# EAGLE design Speaker Amplifier (EAGLE 7.2.0)
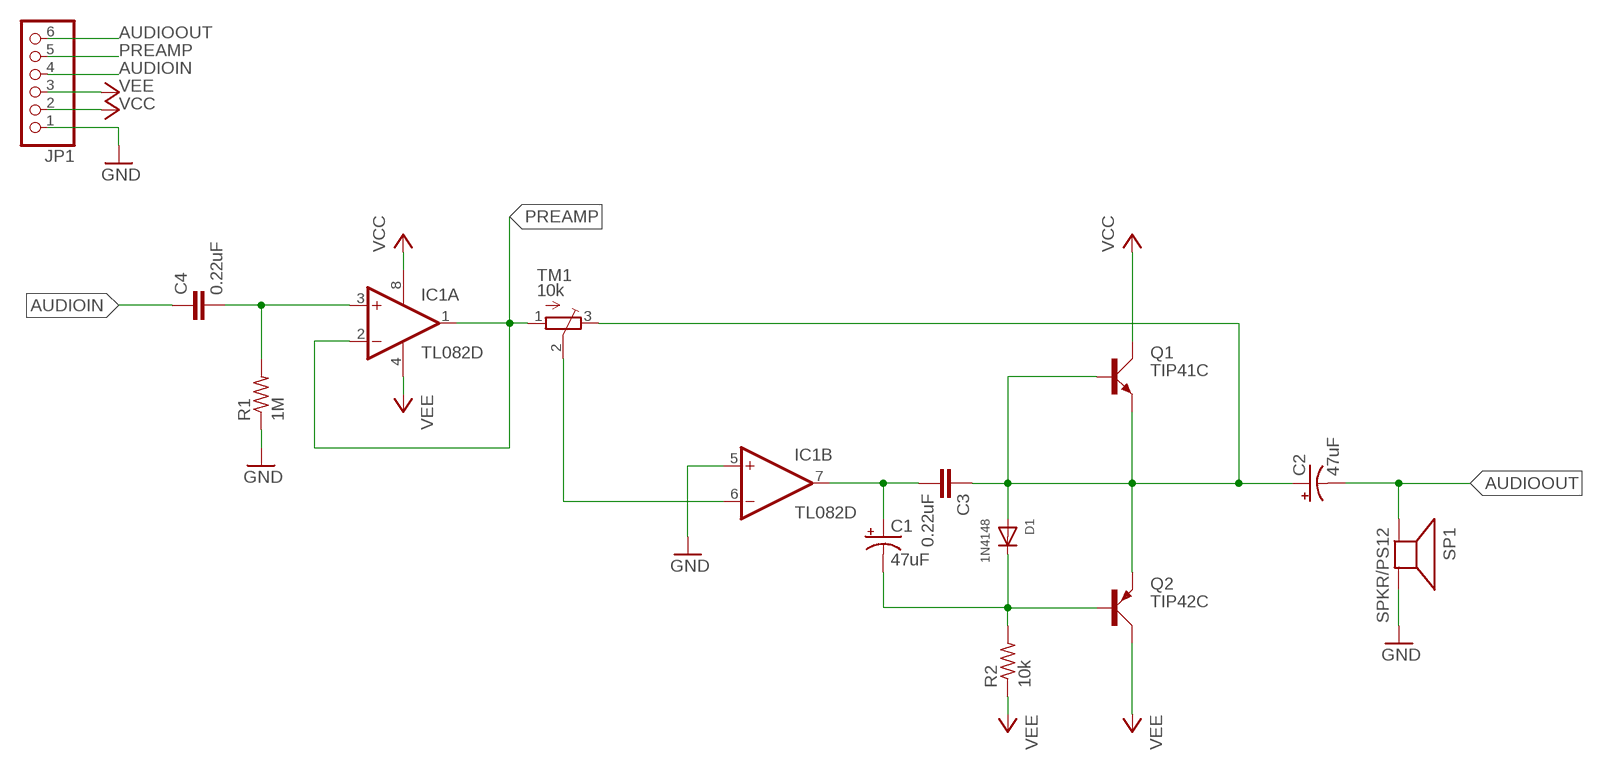
[diagram p0: schematic, sheet 1]

## Parts
C1  47uF  CPOL-US153CLV-0810  [153CLV-0810]
C2  47uF  CPOL-US153CLV-0810  [153CLV-0810]
C3  0.22uF  C-EUC0805  [C0805]
C4  0.22uF  C-EUC0805  [C0805]
D1  1N4148  DIODESOD-323F  [SOD-323F]
IC1  TL082D  [SO08]
JP1  PINHD-1X6-3.5MM  [1X06-3.5MM]
Q1  TIP41C  [TO220AV]
Q2  TIP42C  [TO220AV]
R1  1M  R-US_R0805  [R0805]
R2  10k  R-US_R0805  [R0805]
SP1  SPKR/PS12  SPEAKER/PS12  [PS12]
TM1  10k  TRIMPOTTC33X  [TC33X]

## Nets
AUDIOIN: C4.1 JP1.4
AUDIOOUT: C2.- JP1.6 SP1.P$1(+)
GND: IC1.5(B:+IN) JP1.1 R1.1 SP1.P$2(-)
N$1: C4.2 IC1.3(A:+IN) R1.2
N$3: C1.- D1.C Q2.B R2.2
N$4: C1.+ C3.2 IC1.7(B:OUT)
N$5: C2.+ C3.1 D1.A Q1.B Q1.E Q2.E TM1.3(E)
N$8: IC1.6(B:-IN) TM1.2(S)
PREAMP: IC1.1(A:OUT) IC1.2(A:-IN) JP1.5 TM1.1(A)
VCC: IC1.4(P:V-) IC1.8(P:V+) JP1.2 JP1.3 Q1.C Q2.C R2.1 ; supply symbol labelled VEE

## Library data of the parts
C1 C2 = resistor:CPOL-US: POLARIZED CAPACITOR, American symbol
C3 C4 = resistor:C-EU: CAPACITOR, European symbol
D1 = adafruit:DIODE: Diode SMADIODE - SMA Surface Mount Package 20V 1A Schottky Diode Digikey: 641-1014-6-ND DO-1N4148 - Through Hole Small Current Diode SOD-123 20V 1 A (.5mV Vf) Schottky Diode - Digikey: MBRX120TPMSCT-ND SOD-323 10V 570mA (.38mV Vf, 3ns) Schottky Diode - Digikey: ZLLS410CT-ND SOD-523 30V 30mA Schottky Diode (RB751S-40TE61) - Digikey: RB751S-40TE61CT-ND SOT23-R/W - SOT23 Package (R = Solder Paste/Reflow Ovens, W = Hand-Soldering) BAT54Film 40V 300mA - Digikey: 497-7162-1-ND
IC1 = linear:TL082: OP AMP Data sheet <http://www.ti.com/lit/ds/symlink/tl084a . pdf>; DATA_SHEET: <a href="http://www.ti.com/lit/ds/symlink/tl084a.pdf"> Data sheet </a>
JP1 = adafruit:PINHD-1X6: PIN HEADER
Q1 = transistor-power:TIP41C: NPN TRANSISTOR
Q2 = transistor-power:TIP42C: PNP TRANSISTOR
R1 R2 = resistor:R-US_: RESISTOR, American symbol
SP1 = adafruit:SPEAKER: SPEAKER Source: Buerklin Added PS12 (for part # PS1240 piezo) http://www.ladyada.net/library/pcb/eaglelibrary.html
TM1 = adafruit:TRIMPOT: SMT trimmer potentiometer part number TC33X http://www.ladyada.net/library/eagle

## Board
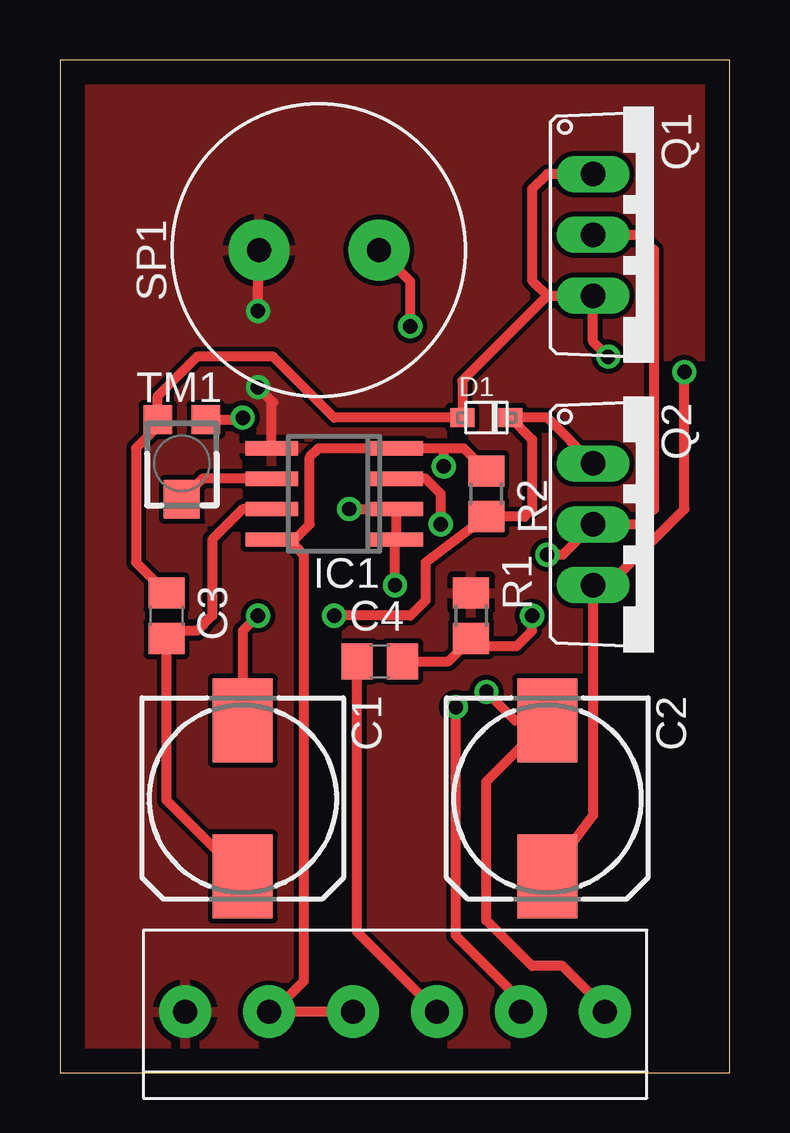
[diagram p1: board, top side]
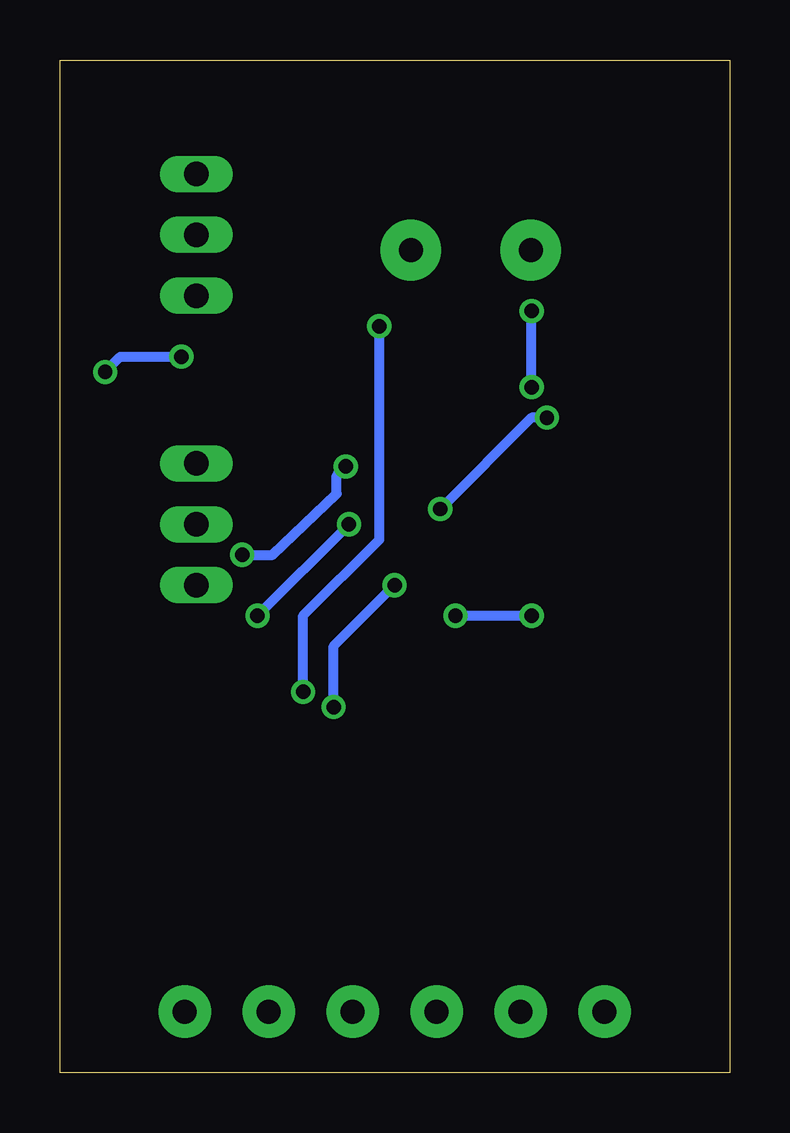
[diagram p2: board, bottom side, seen from below]

Size 27.92 x 42.22 mm. Coordinates in mm from the lower left corner, seen from the top.
Outline: 0,0 27.92,0 27.92,42.22 0,42.22 0,0
Copper layers (1*16): Top 0.035mm / dielectric 1.5mm / Bottom 0.035mm
Design rules "default": minimum track width 10mil, minimum drill 24mil, track to track 8mil, track to pad 8mil, pad to pad 8mil, via to via 8mil, smd to smd 8mil, copper to edge 40mil, drill to drill 8mil, minimum pad ring 10mil, minimum via ring 8mil, stop-mask expansion 4mil, vias tented up to drill 0mil, thermal gap 10mil

### Footprints (pad centres in the part's own frame; a part is rotated, then mirrored left to right if it is on the bottom)
153CLV-0810 = smd 3.5 x 2.5: + 3.25,0; - -3.25,0
C0805 = smd 1.3 x 1.5: 1 -0.95,0; 2 0.95,0
SOD-323F = smd 1 x 0.8: A -1,0; C 1,0
SO08 = smd 0.6 x 2.2: 1 -1.905,-2.6; 2 -0.635,-2.6; 3 0.635,-2.6; 4 1.905,-2.6; 5 1.905,2.6; 6 0.635,2.6; 7 -0.635,2.6; 8 -1.905,2.6
1X06-3.5MM = drill 1 pad 2.184: 1 -8.75,0; 2 -5.25,0; 3 -1.75,0; 4 1.75,0; 5 5.25,0; 6 8.75,0
TO220AV = drill 1.016 long: B -2.54,-2.54; C 0,-2.54; E 2.54,-2.54
R0805 = smd 1.3 x 1.5: 1 -0.95,0; 2 0.95,0
PS12 = drill 1 pad 2.54: P$1 -2.5,0; P$2 2.5,0
TC33X = smd 1.2 x 1.2: 1 -1,-1.825; 3 1,-1.825 | smd 1.5 x 1.6: 2 0,1.5

### Placement (x,y rotation side)
C1  7.62,11.43 270 top
C2  20.32,11.43 270 top
C3  4.45,19.05 270 top
C4  13.34,17.14 0 top
D1  17.78,27.3 0 top
IC1  11.43,24.13 90 top
JP1  13.97,2.54 0 top
Q1  24.77,34.92 270 top
Q2  24.77,22.86 270 top
R1  17.14,19.05 270 top
R2  17.78,24.13 270 top
SP1  10.79,34.29 180 top
TM1  5.08,25.4 180 top

### Tracks (layer width: path | path; a pad name or v marks a point on that pad's centre or on a via)
AUDIOIN
  Top 0.406: JP1.4 12.38,5.88 C4.1
AUDIOOUT  (via drill 0.6)
  Top 0.406: JP1.6 22.72,2.68 20.95,4.45 19.68,4.45 17.78,6.35 17.78,12.14 C2.- 18.98,14.68 v17.78,15.88 | v14.61,31.11 14.61,32.98 SP1.P$1
  Bottom 0.406: v17.78,15.88 17.78,19.05 14.61,22.23 v14.61,31.11
GND  (via drill 0.6)
  Top 0.406: IC1.5 8.83,27.88 8.89,27.94 v8.26,28.57 | v8.26,31.75 8.26,34.25 SP1.P$2
  Bottom 0.406: v8.26,28.57 v8.26,31.75
  pour Top: -1.91,46.35 -1.91,-2.54 30.48,-2.54 30.48,46.35
N$1  (via drill 0.6)
  Top 0.406: C4.2 16.19,17.14 R1.2 17.46,17.78 19.05,17.78 19.68,18.41 v19.68,19.05 | v15.88,22.86 15.88,24.13 15.24,24.77 IC1.3
  Bottom 0.406: v19.68,19.05 v15.88,22.86
N$3  (via drill 0.6)
  Top 0.406: Q2.B 20.32,27.3 D1.C 19.68,26.4 19.68,23.5 19.37,23.18 R2.2 15.24,21.27 15.24,19.68 14.61,19.05 v11.43,19.05 | v8.26,19.05 7.62,18.41 C1.-
  Bottom 0.406: v11.43,19.05 v8.26,19.05
N$4
  Top 0.406: C1.+ 4.45,11.36 C3.2 4.76,18.41 5.71,18.41 6.35,19.05 6.35,22.23 7.62,23.5 IC1.7
N$5  (via drill 0.6)
  Top 0.406: C3.1 3.17,21.27 3.17,26.04 4.08,26.94 TM1.3 4.08,28.21 5.71,29.84 8.89,29.84 11.43,27.3 D1.A 16.78,28.84 20.32,32.38 | C2.+ 22.23,10.72 Q2.E 22.86,20.32 26.04,23.5 v26.04,29.21 | Q1.B 20.32,37.47 19.68,36.83 19.68,33.02 20.32,32.38 | 20.32,32.38 Q1.E 22.23,30.48 v22.86,29.84
  Bottom 0.406: v26.04,29.21 25.4,29.84 v22.86,29.84
N$8
  Top 0.406: IC1.6 5.95,24.77 TM1.2
PREAMP  (via drill 0.6)
  Top 0.406: JP1.5 19.22,3 16.51,5.71 v16.51,15.24 | v13.97,20.32 13.97,22.16 IC1.1 IC1.2 v12.06,23.5 | TM1.1 7.54,27.23 v7.62,27.3
  Bottom 0.406: v16.51,15.24 16.51,17.78 v13.97,20.32 | v7.62,27.3 8.26,27.3 v12.06,23.5
VCC  (via drill 0.6)
  Top 0.406: JP1.3 JP1.2 8.89,2.54 10.16,3.81 10.16,21.59 9.78,21.97 9.78,22.23 | Q1.C 24.13,34.92 24.77,34.29 24.77,23.5 24.13,22.86 Q2.C 20.95,21.59 v20.32,21.59 | IC1.8 9.78,22.23 | 9.78,22.23 10.41,22.86 10.41,25.65 10.79,26.04 IC1.4 16,26.04 | 16,26.04 16.82,26.04 R2.1 | v16,25.27 16,26.04
  Bottom 0.406: v20.32,21.59 19.05,21.59 16.38,24.13 16.38,24.89 v16,25.27